# EAGLE design GDEnvSensorGW_1_14 (EAGLE 8.2.1)
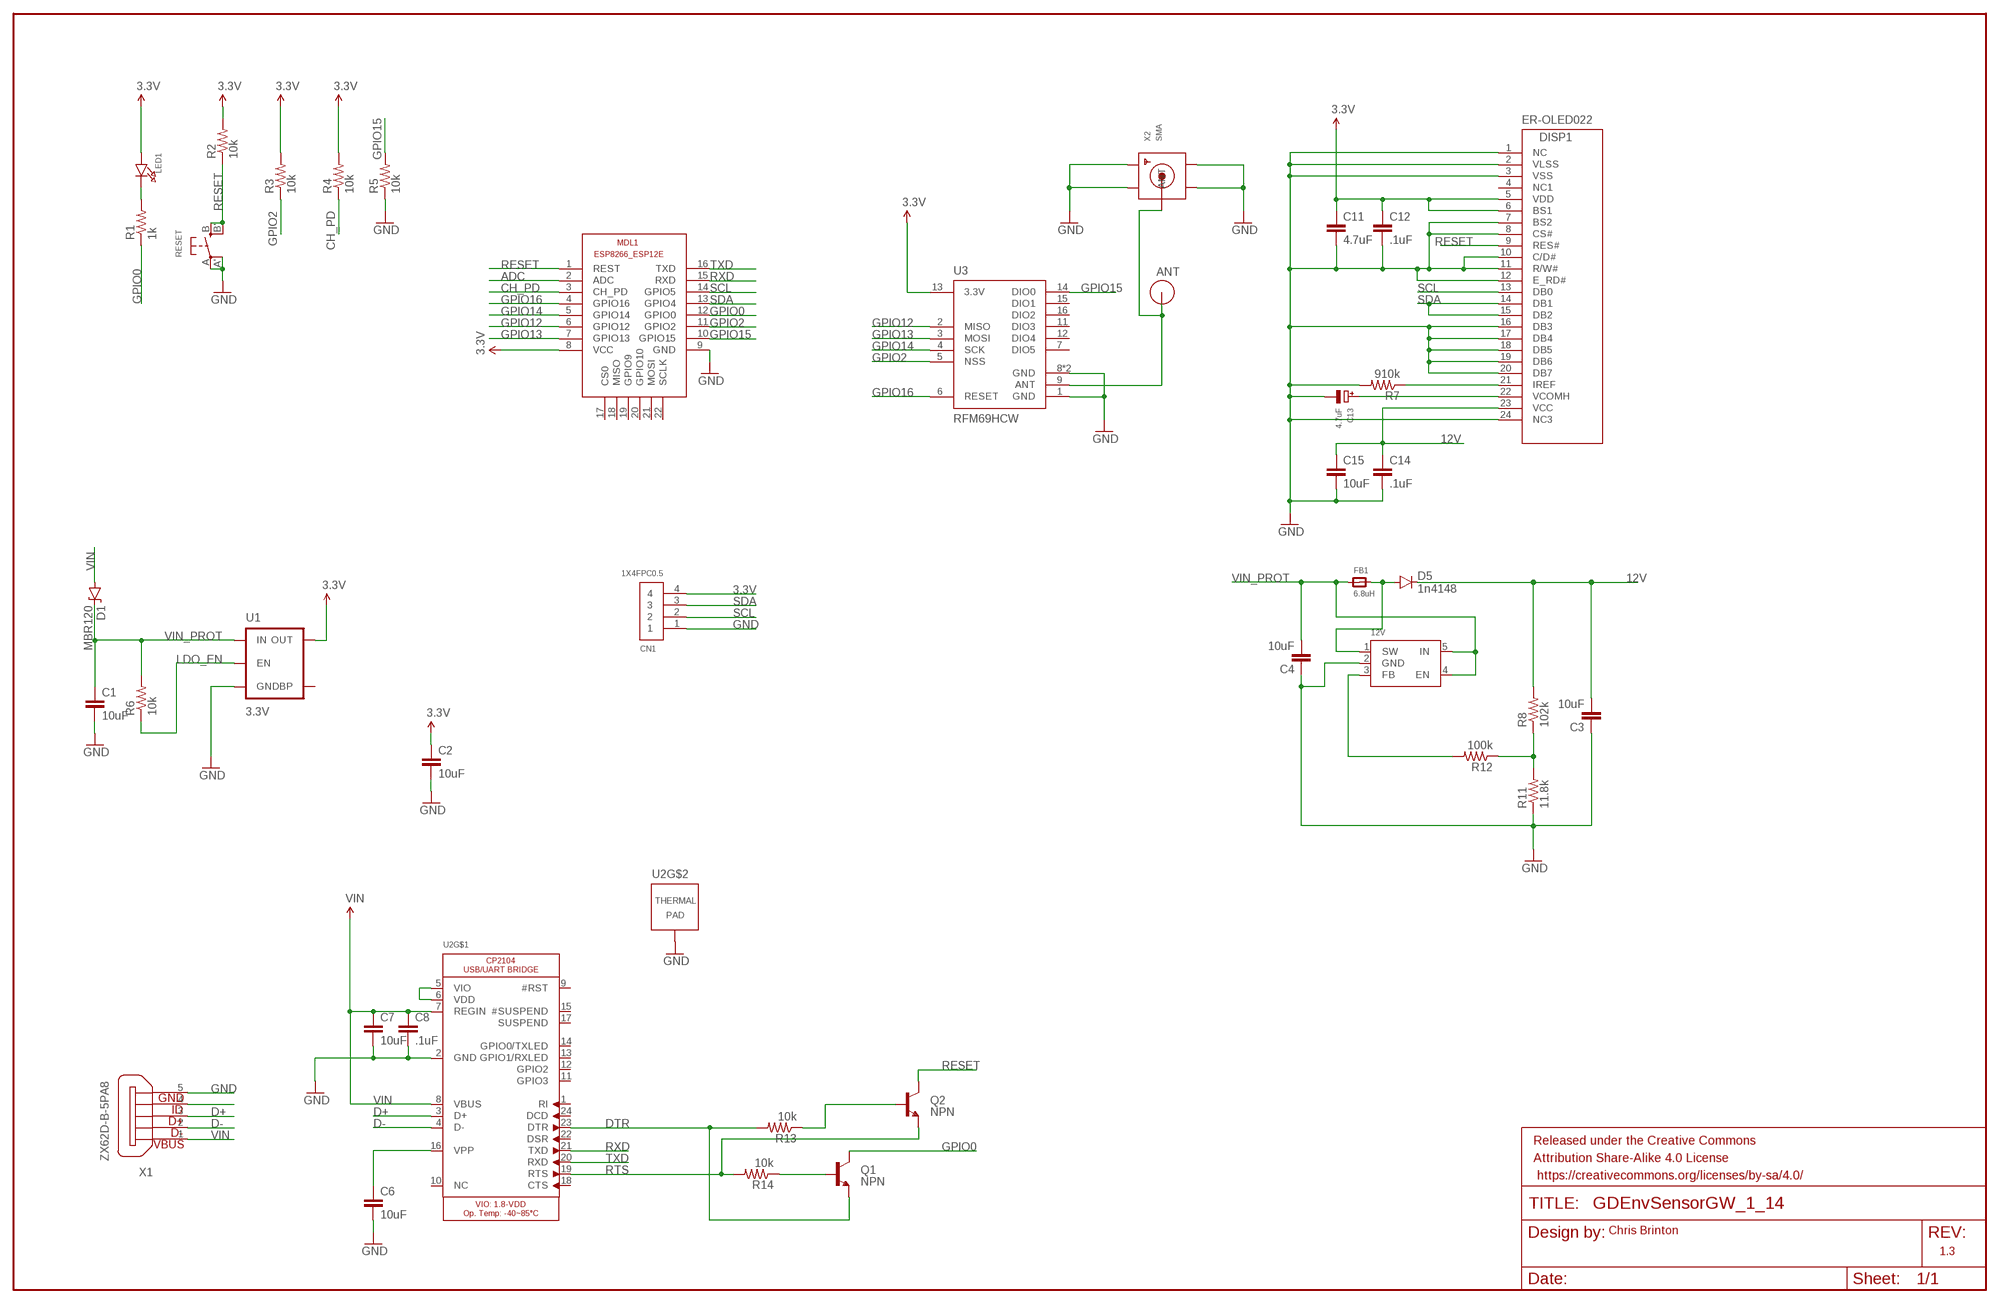
[diagram p0: schematic, sheet 1]

## Parts
12V  MP1541_SOT23-5  [SOT23-5]
ANT  RFM12B_ANTENNA  [RFM12B-ANTENNA]
C1  10uF  10UF10V10%(0805)  [0805-CAP]
C2  10uF  10UF10V10%(0805)  [0805-CAP]
C3  10uF  10UF10V10%(0805)  [0805-CAP]
C4  10uF  10UF10V10%(0805)  [0805-CAP]
C6  10uF  10UF10V10%(0805)  [0805-CAP]
C7  10uF  10UF10V10%(0805)  [0805-CAP]
C8  .1uF  10UF10V10%(0805)  [0805-CAP]
C11  4.7uF  10UF10V10%(0805)  [0805-CAP]
C12  .1uF  10UF10V10%(0805)  [0805-CAP]
C13  4.7uF  CAP_TANTALUMA/3216_REFLOW  [EIA3216-18/A-R]
C14  .1uF  10UF10V10%(0805)  [0805-CAP]
C15  10uF  10UF10V10%(0805)  [0805-CAP]
CN1  1X4FPC0.5  [FPC_0.5MM-4]
D1  MBR120  DIODE-ZENER16V  [SOD-123]
D5  1n4148  DIODEBAS16  [SOD-323]
DISP1  ER-OLED022  [ER-OLED022]
FB1  6.8uH  FERRITE_0805  [_0805]
FRAME1  FRAME-LEDGER  [CREATIVE_COMMONS]
LED1  LED0805  [CHIPLED_0805]
MDL1  ESP8266-ESP12F  ESP8266-12EESP8266-ESP12E  [ESP8266-ESP12E]
Q1  NPN  TRANSISTOR_NPNMMBT2222A  [SOT23-3]
Q2  NPN  TRANSISTOR_NPNMMBT2222A  [SOT23-3]
R1  1k  R-US_R0805  [R0805]
R2  10k  R-US_R0805  [R0805]
R3  10k  R-US_R0805  [R0805]
R4  10k  R-US_R0805  [R0805]
R5  10k  R-US_R0805  [R0805]
R6  10k  R-US_R0805  [R0805]
R7  910k  R-US_R0805  [R0805]
R8  102k  R-US_R0805  [R0805]
R11  11.8k  R-US_R0805  [R0805]
R12  100k  R-US_R0805  [R0805]
R13  10k  R-US_R0805  [R0805]
R14  10k  R-US_R0805  [R0805]
RESET  SWITCH_TACT_SMT4.6X2.8  [BTN_KMR2_4.6X2.8]
U1  3.3V  V_REG_MIC52193.3V  [SOT23-5]
U2  CP2104  [QFN24_4MM_SMSC]
U3  RFM69HCW  [RFM69HCW-XXXS2]
X1  ZX62D-B-5PA8  [ZX62D-B-5PA8]
X2  SMA  SMACONNECTOR_EDGE_UFL  [SMA_EDGELAUNCH_UFL]

## Nets
3.3V: C2.1 C11.1 C12.1 CN1.4 DISP1.5(VDD) DISP1.6(BS1) LED1.A MDL1.8(VCC) R2.2 R3.2 R4.2 U1.5(OUT) U3.13(3.3V)
12V: C3.2 C14.1 C15.1 D5.C DISP1.23(VCC) R8.2
ADC: MDL1.2(ADC)
ANT: ANT.P$1 U3.9(ANT) X2.P(ANT)
CH_PD: MDL1.3(CH_PD) R4.1
D+: U2.3(D+) X1.3
D-: U2.4(D-) X1.2
DTR: Q1.2(E) R13.2 U2.23(DTR)
GND: 12V.2(GND) C1.2 C2.2 C3.1 C4.1 C6.2 C7.2 C8.2 C11.2 C12.2 C13.- C14.2 C15.2 CN1.1 DISP1.1(NC) DISP1.2(VLSS) DISP1.3(VSS) DISP1.7(BS2) DISP1.8(CS#) DISP1.10(C/D#) DISP1.11(R/W#) DISP1.12(E_RD#) DISP1.16(DB3) DISP1.17(DB4) DISP1.18(DB5) DISP1.19(DB6) DISP1.20(DB7) DISP1.24(NC3) MDL1.9(GND) R5.1 R7.2 R11.1 RESET.A'(P1) RESET.A(P) U1.2(GND) U2.2(GND) U2.THERM(TP) U3.1(GND) U3.8(GND) U3.10(GND) X1.5 X2.GND@1(GND1) X2.GND@2(GND2) X2.GND@3(GND3) X2.GND@4(GND4)
GPIO0: MDL1.12(GPIO0) Q1.3(C) R1.1
GPIO2: MDL1.11(GPIO2) R3.1 U3.5(NSS)
GPIO12: MDL1.6(GPIO12) U3.2(MISO)
GPIO13: MDL1.7(GPIO13) U3.3(MOSI)
GPIO14: MDL1.5(GPIO14) U3.4(SCK)
GPIO15: MDL1.10(GPIO15) R5.2 U3.14(DIO0)
GPIO16: MDL1.4(GPIO16) U3.6(RESET)
LDO_EN: R6.1 U1.3(EN)
N$1: U2.5(VIO) U2.6(VDD)
N$3: LED1.C R1.2
N$4: C13.+ DISP1.22(VCOMH)
N$5: C6.1 U2.16(VPP)
N$8: 12V.1(SW) D5.A FB1.2
N$9: Q2.1(B) R13.1
N$10: R8.1 R11.2 R12.1
N$11: DISP1.21(IREF) R7.1
N$15: 12V.3(FB) R12.2
N$16: X1.4
N$17: Q1.1(B) R14.1
RESET: DISP1.9(RES#) MDL1.1(REST) Q2.3(C) R2.1 RESET.B'(S1) RESET.B(S)
RTS: Q2.2(E) R14.2 U2.19(RTS)
RXD: MDL1.15(RXD) U2.21(TXD)
SCL: CN1.2 DISP1.13(DB0) MDL1.14(GPIO5)
SDA: CN1.3 DISP1.14(DB1) DISP1.15(DB2) MDL1.13(GPIO4)
TXD: MDL1.16(TXD) U2.20(RXD)
VIN: C7.1 C8.1 D1.A U2.7(REGIN) U2.8(VBUS) X1.1
VIN_PROT: 12V.4(EN) 12V.5(IN) C1.1 C4.2 D1.C FB1.1 R6.2 U1.1(IN)
Unconnected: DISP1.4(NC1) MDL1.17(CS0) MDL1.18(MISO) MDL1.19(GPIO9) MDL1.20(GPIO10) MDL1.21(MOSI) MDL1.22(SCLK) U1.4(BP) U2.1(RI) U2.9(#RST) U2.10(NC) U2.11(GPIO3) U2.12(GPIO2) U2.13(GPIO1/RXLED) U2.14(GPIO0/TXLED) U2.15(#SUSPEND) U2.17(SUSPEND) U2.18(CTS) U2.22(DSR) U2.24(DCD) U3.7(DIO5) U3.11(DIO3) U3.12(DIO4) U3.15(DIO1) U3.16(DIO2) X1.S1 X1.S2 X1.S3 X1.S4

## Notes on the sheet
- Chris Brinton
- 1.3

## Library data of the parts
12V = GDTech:MP1541_SOT23-5: SOT23-5 MP1541 Voltage Boost The MP1541 is a 5-pin thin SOT23 current mode step up converter intended for small, low power applications
ANT = LowPowerLab:RFM12B_ANTENNA; LABEL: ANT
C1-C4 C6-C8 C11 C12 C14 C15 = SparkFun-Capacitors:10UF10V10%(0805): CAP-11330; PROD_ID: CAP-11330
C13 = microbuilder:CAP_TANTALUM: Tantalum Capacitors Wave footprints have larger pads and are meant to be used for hand soldering. Reflow footprints are optimised for solder paste and a reflow oven. EIA3216-18/A-[R/W] - Size A / 3216-18 / 1206 footprint 4.7µF 25V 10% Tantalum Capacitor 10µF 16V 10% Tantalum Capacitor [Digikey: 495-2236-2-ND] EIA3528-21/B-[R/W] - Size B / 3528-21 47µF 10V 10% Tantalum Capactior [Digikey: 495-2216-1-ND] EIA6032-28/C-[R/W] - Size C / 6032-28 10µF 35V 20% Tantalum Capacitor [Digikey: 495-2285-1-ND] 100µF 16V 10% Tantalum Capactior [Digikey: 399-5214-1-ND]
CN1 = adafruit:1X4: 4-pin connector
D1 = SparkFun-DiscreteSemi:DIODE-ZENER: Zener Diode Production Part - 8199 3.4V Zener Voltage; PROD_ID: DIO-12440; VALUE: 16V
D5 = SparkFun-DiscreteSemi:DIODE: Diode These are standard reverse protection diodes and small signal diodes. SMA package can handle up to about 1A. SOD-323 can handle about 200mA. What the SOD-323 package when ordering, there are some mfgs out there that are 5-pin packages.; PROD_ID: DIO-09646; VALUE: 250mA/100V
DISP1 = GDTech:ER-OLED022: East Rising 2.2" OLED display 128x32 24 pin .5mm pitch FPC connector
FB1 = microbuilder:FERRITE: Ferrite Bead 0603 MMZ1608B121C - 120 Ohm @ 100MHz, 600mA, 0.15 Ohm DC Resistance - Digikey: 445-2164-1-ND BK1608HW121-T - 120 Ohm, 600mA Ferrite Chip - Digikey: 587-1876-2-ND 0805 HZ0805B272R-10 - 2.7K Ohm @ 100MHz, 200mA, 0.8 Ohm DC Resistance - Digikey: 240-2504-1-ND (see also Murata BLM21BD272SN1L) MMZ2012Y152B - 1.5K Ohm @ 100MHz, 500mA, 0.4 Ohm DC Resistance - Digikey: 445-1560-1-ND - Mainly for high frequency (80-400MHz) MMZ2012R102A - 1K Ohm @ 100MHz, 500mA, 0.3 Ohm DC Resistance - Digikey: 445-1555-2-ND - More general purpose (10-200MHz)
FRAME1 = SparkFun-Aesthetics:FRAME-LEDGER: Schematic Frame Standard 11x14 US Ledger frame
LED1 = microbuilder:LED: LED 0603 - 0603 Surface Mount Package 2mA: Green LED - Low Power (3.9mcd, 2ma, 1.7Vf) - Digikey: 475-2709-2-ND Orange LED - Low Power (9.8mcd, 2ma, 1.8Vf) - Digikey: 475-1194-2-ND Red LED - Low Power (5mcd, 2ma, 1.8Vf) - Digikey: 475-1195-2-ND Yellow LED - Low Power (7mcd, 2ma, 1.8Vf) - Digikey: 475-1196-2-ND 5mA: Blue LED - Low Power (17mcd, 5ma, 2.9Vf) - Digikey: LNJ937W8CRACT-ND 0805 - 0805 Surface Mount Package 2mA: Red LED (8.8mcd, 2mA, 1.8Vf, Clear) - Low Power [Digikey: 475-2510-1-ND] Green LED (5mcd, 2mA, 1.8Vf, Clear) - Low Power [Digikey: 475-2730-1-ND] Yellow LED (11.3mcd, 2mA, 1.8Vf, Clear) - Low Power [Digikey: 475-2555-1-ND] 20mA: Red LED (104mcd, 20mA, Diffused) - LS R976 [Digikey: 475-1278-6-ND] Red LED (12mcd, 20mA, 2.0Vf, Clear) - APT2012EC [Digikey: 754-1128-1-ND] Green LED (15mcd, 20mA, 2.2Vf, Clear) - APT2012GC [Digikey: 754-1131-1-ND] Orange LED (160mcd, 20mA, 2.1Vf, Clear) - APT2012SECK [Digikey: 754-1130-1-ND] 1206 - 1206 Surface Mount Package Green LED (26mcd, 20mA, Diffused) - LG N971 [Digikey: 475-1407-6-ND] Red LED (15mcd, 20mA, Diffused) - LH N974 [Digikey: 475-1416-6-ND]
MDL1 = ESP12E:ESP8266-12E: ESP8266-12E with additional I/O and GPIO04/05 corrected The author cannot warrant that this library is free from error or will meet your specific requirements. Created by PuceBaboon.com. Komagane, Nagano, JAPAN
Q1 Q2 = SparkFun-DiscreteSemi:TRANSISTOR_NPN: Generic NPN BJT MMBT2222A - TRANS-08049 (SOT-23, 1A 40V) MPSA42 - TRANS-09116 (SOT-23, 500mA 300V) MMBT5088LT1G - TRANS-11160 (SOT-23, 50 mA 30V) BC547 - COM-08928 <http://www.sparkfun.com/products/8928> (TO-92 45V 100mA) (1.Collector 2.Base 3.Emitter) 2N3904 - COM-00521 <http://www.sparkfun.com/products/521> (TO-92 40V 200mA) (1.Emitter 2.Base 3.Collector) P2N2222A - COM-12852 <http://www.sparkfun.com/products/12852> (TO-92 40V 600mA) (1.Collector 2.Base 3.Emitter); PROD_ID: TRANS-08049; VALUE: MMBT2222A
R1-R8 R11-R14 = adafruit:R-US_: RESISTOR, American symbol
RESET = microbuilder:SWITCH_TACT_SMT: SMT Tact Switches 6x6mm - Digikey: P12940SCT-ND KMR2 (4.6x2.8mm) - Digikey: 401-1426-1-ND EVQ-PQHB55 - Light Touch, 160GF (4.5x4.5mm) - Digikey: P8090SCT-ND
U1 = SparkFun-PowerIC:V_REG_MIC5219: V_REG MIC5219 Standard 3.3V and 5V 500mA LDO voltage regulator in SOT-23 layout. Micrel part MIC5219. BP (by-pass) pin is used to lower output noise with 470pF cap, may be left open.; PROD_ID: VREG-09872; VALUE: MIC5219 3.3V
U2 = GDTech:CP2104: CP2104 - USB to UART Bridge VDD Output: 3.45V
U3 = SparkFun-RF:RFM69H; PROD_ID: IC-11997, IC-12053
X1 = GDTech:ZX62D-B-5PA8: Micro USB Type B Connector - Standard, Shell Through Hole Source: http://www.hirose.co.jp/cataloge_hp/ed_ZX_20140804.pdf; MF: Hirose; MPN: ZX62D-B-5PA8; OC_FARNELL: 2300438; OC_NEWARK: 69W0712
X2 = adafruit:SMACONNECTOR: SMA Connector 90° DIP SMA Connector, 50 Ohm (4UConnector: 07259)

## Board
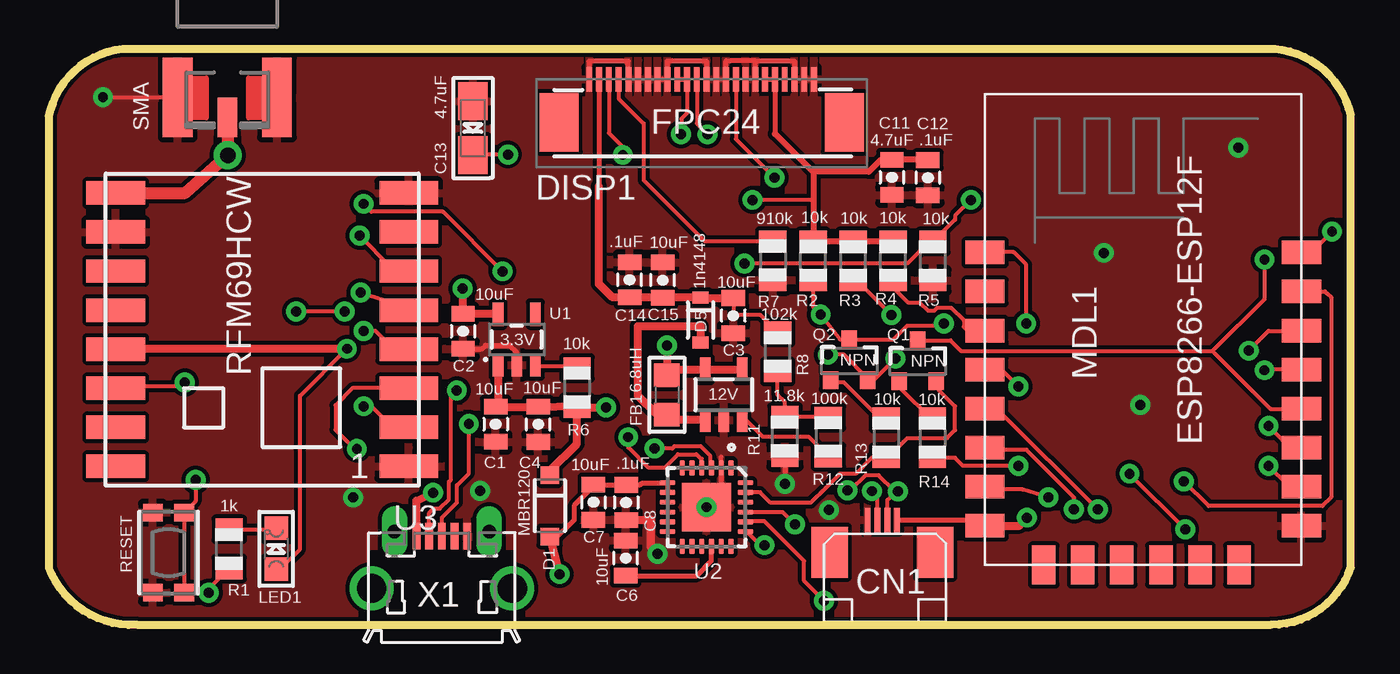
[diagram p1: board, top side]
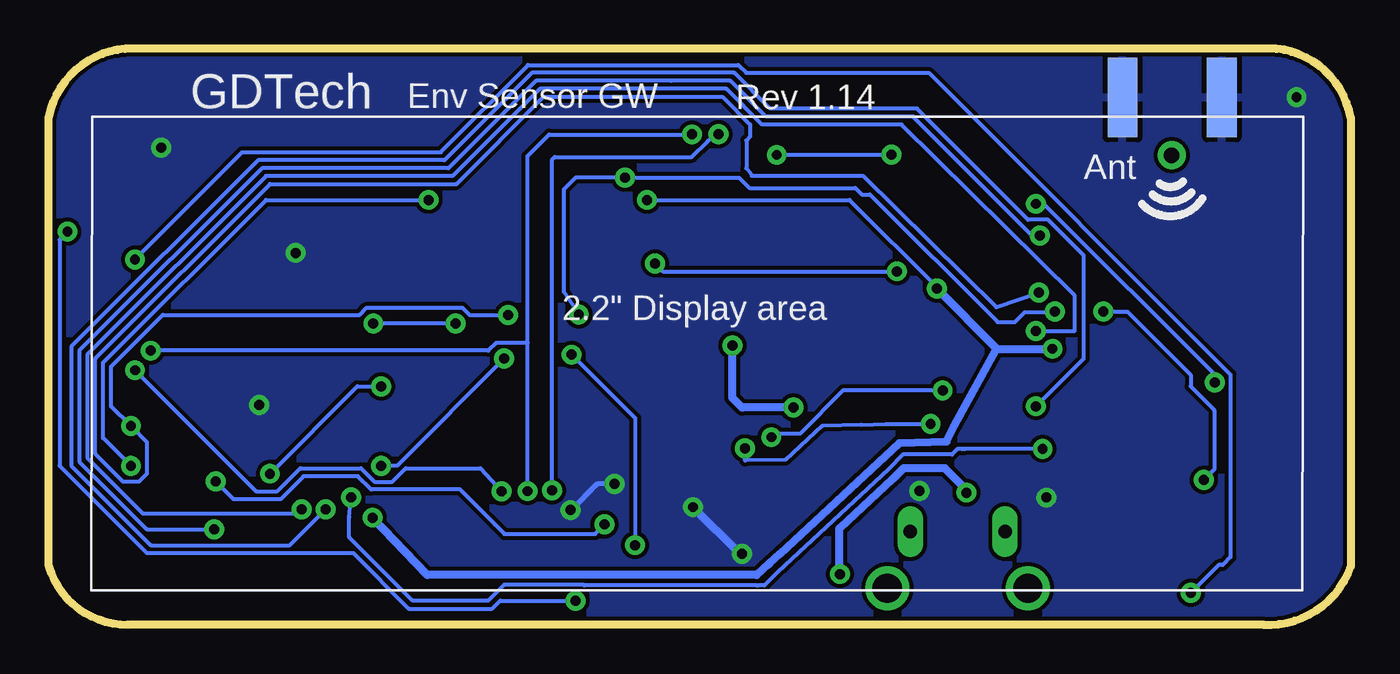
[diagram p2: board, bottom side, seen from below]

Size 66.64 x 29.5 mm. Coordinates in mm from the lower left corner, seen from the top.
Outline: 0,25.99 arc-74 3.8,29.5 62.74,29.5 arc-74 66.64,26.04 66.64,3 arc-74 62.59,0.01 4.49,0.01 arc-74 0,2.97 0,25.99
Copper layers (1*16): Top 0.035mm / dielectric 1.5mm / Bottom 0.035mm
Design rules "SparkFun": minimum track width 8mil, minimum drill 20mil, track to track 8mil, track to pad 8mil, pad to pad 8mil, via to via 8mil, smd to smd 8mil, copper to edge 8mil, drill to drill 8mil, minimum pad ring 12mil, minimum via ring 10mil, stop-mask expansion 4mil, vias tented up to drill 20mil, thermal gap 10mil

### Footprints (pad centres in the part's own frame; a part is rotated, then mirrored left to right if it is on the bottom)
SOT23-5 = smd 0.55 x 1.2: 1 -0.95,-1.3; 2 0,-1.3; 3 0.95,-1.3; 4 0.95,1.3; 5 -0.95,1.3
RFM12B-ANTENNA = drill 0.8 pad 1.422: P$1 0,0
0805-CAP = smd 0.8 x 1.2: 1 -0.9,0; 2 0.9,0
EIA3216-18/A-R = smd 1.95 x 1.5: + 1.375,0; - -1.375,0
FPC_0.5MM-4 = smd 0.3 x 1.25: 1 -0.75,-0.45; 2 -0.25,-0.45; 3 0.25,-0.45; 4 0.75,-0.45 | smd 1.85 x 2.6: MT -2.7,-2.1; MT2 2.7,-2.1
SOD-123 = smd 0.9 x 0.95: A 1.575,0; C -1.575,0
SOD-323 = smd 0.63 x 0.83: A 1.15,0; C -1.15,0
ER-OLED022 = smd 0.3 x 1.25: 1 5.75,12.905; 2 5.25,12.905; 3 4.75,12.905; 4 4.25,12.905; 5 3.75,12.905; 6 3.25,12.905; 7 2.75,12.905; 8 2.25,12.905; 9 1.75,12.905; 10 1.25,12.905; 11 0.75,12.905; 12 0.25,12.905; 13 -0.25,12.905; 14 -0.75,12.905; 15 -1.25,12.905; 16 -1.75,12.905; 17 -2.25,12.905; 18 -2.75,12.905; 19 -3.25,12.905; 20 -3.75,12.905; 21 -4.25,12.905; 22 -4.75,12.905; 23 -5.25,12.905; 24 -5.75,12.905 | smd 2 x 3: MOUNT1 -7.3,10.705; MOUNT2 7.3,10.705
_0805 = smd 1.2 x 1.3: 1 -1.016,0; 2 1.016,0
CHIPLED_0805 = smd 1.2 x 1.2: A 0,-1.05; C 0,1.05
ESP8266-ESP12E = smd 2 x 1.2: 1 0,16; 2 0,14; 3 0,12; 4 0,10; 5 0,8; 6 0,6; 7 0,4; 8 0,2; 9 16.2,2; 10 16.2,4; 11 16.2,6; 12 16.2,8; 13 16.2,10; 14 16.2,12; 15 16.2,14; 16 16.2,16 | smd 1.2 x 2: 17 11,0; 18 3,0; 19 5,0; 20 13,0; 21 7,0; 22 9,0
SOT23-3 = smd 0.8 x 0.9: 1 -0.95,-1; 2 0.95,-1; 3 0,1.1
R0805 = smd 1.1 x 1.4: 1 -1,0; 2 1,0
BTN_KMR2_4.6X2.8 = smd 0.9 x 1: A 2.05,0.8; A' -2.05,0.8; B 2.05,-0.8; B' -2.05,-0.8
QFN24_4MM_SMSC = smd 0.8 x 0.28: 1 -2,1.25; 2 -2,0.75; 3 -2,0.25; 4 -2,-0.25; 5 -2,-0.75; 6 -2,-1.25; 13 2,-1.25; 14 2,-0.75; 15 2,-0.25; 16 2,0.25; 17 2,0.75; 18 2,1.25 | smd 0.28 x 0.8: 7 -1.25,-2; 8 -0.75,-2; 9 -0.25,-2; 10 0.25,-2; 11 0.75,-2; 12 1.25,-2; 19 1.25,2; 20 0.75,2; 21 0.25,2; 22 -0.25,2; 23 -0.75,2; 24 -1.25,2 | smd 2.5 x 2.5: THERM 0,0
RFM69HCW-XXXS2 = smd 3 x 1.2: 1 -7.5,7; 2 -7.5,5; 3 -7.5,3; 4 -7.5,1; 5 -7.5,-1; 6 -7.5,-3; 7 -7.5,-5; 8 -7.5,-7; 9 7.5,-7; 10 7.5,-5; 11 7.5,-3; 12 7.5,-1; 13 7.5,1; 14 7.5,3; 15 7.5,5; 16 7.5,7
ZX62D-B-5PA8 = smd 1.35 x 0.4: 1 4.825,1.3; 2 4.825,0.65; 3 4.825,0; 4 4.825,-0.65; 5 4.825,-1.3 | drill 1.5: S1 2.15,-3.6; S2 2.15,3.6 | drill 0.7 long: S3 5.05,2.425; S4 5.05,-2.425
SMA_EDGELAUNCH_UFL = smd 4.064 x 1.524: GND@1 2.032,-2.54; GND@2 2.032,2.54 | smd 4.064 x 1.524 bottom: GND@3 2.032,2.54; GND@4 2.032,-2.54 | smd 2.032 x 1.016: P 3.048,0

### Placement (x,y rotation side)
12V  34.55,11.79 0 top
ANT  9.16,24.05 0 top
C1  22.87,10.27 270 top
C2  21.2,15.03 270 top
C3  35.04,15.84 90 top
C4  25.05,10.27 90 top
C6  29.53,3.42 90 top
C7  27.88,6.28 270 top
C8  29.55,6.27 270 top
C11  43.16,22.91 270 top
C12  45,22.9 270 top
C13  21.71,25.44 270 top
C14  29.73,17.67 90 top
C15  31.42,17.66 90 top
CN1  42.67,5.82 0 top
D1  25.64,6.1 270 top
D5  33.36,15.61 270 top
DISP1  33.42,15.03 0 top
FB1  31.64,11.78 270 top
FRAME1  1.73,-12.1 0 top  (outside the outline)
LED1  11.64,3.9 0 top
MDL1  47.92,3.07 0 top
Q1  44.47,13.47 0 top
Q2  40.97,13.52 0 top
R1  9.23,3.89 90 top
R2  39.12,18.64 90 top
R3  41.17,18.63 90 top
R4  43.22,18.64 90 top
R5  45.25,18.63 90 top
R6  27.04,12.14 270 top
R7  37.06,18.65 270 top
R8  37.31,13.98 90 top
R11  37.68,9.65 90 top
R12  39.9,9.62 270 top
R13  42.86,9.58 270 top
R14  45.23,9.58 270 top
RESET  6.13,3.7 90 top
U1  23.95,14.61 0 top
U2  33.67,6.03 270 top
U3  10.92,15.12 180 top
X1  20.12,-0.28 90 top
X2  9.14,29.04 270 top

### Tracks (layer width: path | path; a pad name or v marks a point on that pad's centre or on a via)
3.3V  (via drill 0.51, 0.51 pad 1.02)
  Top 0.203: 43.41,5.7 CN1.4 | R3.2 43.21,19.63 R4.2 | LED1.A 11.84,2.86 12.86,3.88 12.86,11.73 15.24,14.12 | 39.13,21.76 v36.02,21.76
  Top 0.254: 37.17,25.15 DISP1.5 DISP1.6 | CN1.4 47.63,5.37 MDL1.8
  Top 0.305: 39.13,23.19 39.13,21.76 R2.2 R4.2 | 37.17,25.15 39.13,23.19 | C12.1 44.98,23.81 C11.1 42.58,23.81 41.97,23.2 39.14,23.2 39.13,23.19
  Top 0.406: U1.5 21.23,15.91 C2.1 21.18,15.95 v21.18,17.22 | U3.13 15.24,14.12 v15.26,14.14 | MDL1.8 49.68,5.07 v50.07,5.49
  Bottom 0.203: v36.02,21.76 25.66,21.76 21.19,17.29 v21.18,17.22
  Bottom 0.406: 18.1,14.14 v15.26,14.14 | 18.1,14.14 v21.18,17.22 | v50.07,5.49 47.27,2.56 30.48,2.57 30.41,2.55 29.77,3.12 29.22,3.63 23.11,9.31 20.68,9.38 20.29,10.21 18.16,14.08 18.1,14.14
12V
  Top 0.203: C3.2 35.04,15.95 35.1,15.89 36.4,15.89 R8.2
  Top 0.254: DISP1.23 28.17,22.47 28.15,22.46
  Top 0.406: C3.2 33.38,16.74 D5.C C15.1 C14.1 28.86,16.77 28.15,17.48 28.15,22.46
ANT
  Top 0.61: U3.9 6.97,22.12 ANT.P$1 9.17,24.32 X2.P
CH_PD
  Top 0.203: R4.1 43.22,17.28 43.98,16.52 44.57,16.52 45,16.09 45.33,16.09 45.48,16.24 46.19,16.24 46.83,15.6 46.83,15.26 47,15.09 47.91,15.09 MDL1.3
D+  (via drill 0.51 pad 1.02)
  Top 0.203: U2.3 33.86,8.08 33.86,8.65 33.37,9.14 32.03,9.14 31.92,9.03 v31,9.03 | v21.5,10.29 21.5,7.76 20.89,7.15 20.89,6.26 20.12,5.49 X1.3
  Bottom 0.203: v21.5,10.29 23.81,10.28 25.05,10.24 27.06,10.18 28.94,8.45 31,8.41 v31,9.03
D-  (via drill 0.51, 0.51 pad 1.02)
  Top 0.203: X1.2 19.47,5.73 19.7,5.95 20.01,5.95 20.48,6.43 20.48,7.32 20.59,7.43 20.59,11.7 v20.88,12 | 33.38,8.15 U2.4 33.42,8.52 33.36,8.52 33.14,8.73 32.19,8.73 31.51,8.05 30.7,8.05 29.67,9.08 29.64,9.59 v29.66,9.61
  Bottom 0.203: v20.88,12 24.64,12.01 25.98,12.01 28.2,9.79 29.68,9.79 v29.66,9.61
DTR
  Top 0.203: 39.77,7.02 40.49,7.74 41.3,7.74 42.12,8.55 42.72,8.55 R13.2 42.93,8.55 43.94,9.57 45.98,9.57 46.38,9.97 46.38,11.19 45.57,12.01 45.57,12.41 Q1.2 | 39.77,7.02 39.47,6.72 | 35.82,6.72 U2.23 36.41,6.79 36.95,6.25 39,6.25 39.77,7.02
GND  (via drill 0.51 pad 1.02)
  Top 0.203: DISP1.11 DISP1.10 | DISP1.2 DISP1.1 | U2.2 34.39,8.15 34.39,8.55 34.42,8.6 | X2.GND@1 2.78,27.01 v2.77,27.02
  Top 0.254: DISP1.16 31.68,27.93 31.69,27.93 DISP1.16 | U2.2 34.42,6.78 U2.THERM | C2.2 22.16,14.13 22.35,14.32 23.59,14.32 23.94,13.97 U1.2 | R11.1 v37.68,7.23 v37.69,7.22 | DISP1.24 27.67,28.84 27.66,28.85 27.66,28.88 27.67,28.89 29.66,28.89 DISP1.20 | 31.67,28.89 31.67,28.86 | 31.67,28.89 31.92,28.89 31.9,28.89 33.66,28.89 DISP1.12 | DISP1.10 34.67,28.86 34.67,28.9 34.86,28.89 34.88,28.89 36.16,28.89 | DISP1.7 36.17,28.88 36.16,28.89 | 36.16,28.89 38.15,28.89 38.16,28.88 DISP1.3 | DISP1.16 31.67,28.88 31.67,28.89 | DISP1.17 DISP1.16
  Top 0.406: C8.2 30.78,5.37 30.8,5.39 30.8,3.98 v31.15,3.63
  Bottom 0.254: v37.69,7.22 38.57,7.22 39.94,5.85 v39.94,5.88
  Bottom 0.406: v31.15,3.63 31.27,3.63 U2.THERM
  other vias: 33.67,6.03 54,19.05 60.89,24.44 55.88,11.27 22.08,6.87 15.58,6.52
  pour Top: 4.08,30.46 62.57,29.62 arc-90 66.67,25.52 67.67,3.52 arc-90 63.07,-0.08 3.86,-0.02 arc-90 -0.05,3.04 -0.08,26.19 arc-90
  pour Bottom: 4.27,29.32 63.04,30.03 arc-90 67.77,24.82 66.77,3.52 arc-90 63.27,0.02 4.17,-1.38 arc-90 0.06,2.64 0.07,25.22 arc-90
GPIO0  (via drill 0.51)
  Top 0.203: Q1.3 46.16,14.57 46.7,14.03 59.56,14.03 | 59.56,14.03 62.53,11.06 64.11,11.06 MDL1.12 | v8.18,1.64 8.18,1.85 9.2,2.86 R1.1 | v62.23,18.71 62.23,16.68 59.59,14.04 59.56,14.03
  Bottom 0.203: v8.18,1.64 6.76,3.07 6.56,3.07 6.15,3.47 6.15,12.82 21.59,28.26 30.94,28.26 31.35,28.67 42.12,28.67 46.59,24.2 56.75,24.2 v62.23,18.71
GPIO2  (via drill 0.51)
  Top 0.203: v43.13,15.87 41.51,17.49 41.3,17.49 R3.1 | v62.44,10.18 63.45,9.16 64.06,9.16 MDL1.11 | v15.97,17.02 18.34,16.27 U3.5
  Bottom 0.203: v15.97,17.02 18.14,16.27 24.97,22.99 30.66,22.99 30.94,23.39 30.94,24.81 30.74,25.01 30.74,25.62 32.16,27.04 41.3,27.04 45.77,22.57 55.32,22.57 64.26,13.63 64.26,8.76 62.84,7.33 62.03,7.33 61.62,7.74 61.62,9.36 v62.44,10.18 63.45,11.19 63.45,13.23 60.81,15.87 50.74,15.87 50.37,16.24 45.48,16.24 45.11,15.87 v43.13,15.87
GPIO12  (via drill 0.51)
  Top 0.203: v52.48,5.91 52.48,6.52 50.04,8.96 48.01,8.96 MDL1.6 | v16.11,11.19 16.51,11.19 17.53,10.18 18.34,10.18 U3.2
  Bottom 0.203: v52.48,5.91 54.31,4.08 61.42,4.08 65.48,8.15 65.48,14.24 55.93,23.79 46.38,23.79 41.91,28.26 31.55,28.26 29.72,26.43 22.2,26.43 16.51,20.74 15.5,20.74 13.67,18.92 13.67,13.63 v16.11,11.19
GPIO13  (via drill 0.51, 0.51 pad 1.02)
  Top 0.203: v51.17,6.52 49.84,6.93 48.01,6.93 MDL1.7 | 19.36,12.01 18.54,12.01 U3.3 15.55,12.12 14.67,11.24 14.67,9.99 15.66,9 15.75,9 v15.77,9.02
  Bottom 0.203: v51.17,6.52 51.26,5.5 51.26,4.49 48.01,1.24 44.15,1.24 43.33,2.05 39.27,2.05 39.24,2.02 30.4,2.02 30.35,2 30.32,2.02 30.01,2.02 29.35,2.68 23.66,7.97 22.91,8.72 20.41,8.72 20.12,9.01 19.77,9.01 | v15.77,9.02 18.11,9.02 19.77,9.01 | 19.77,9.01 19.9,9.01
GPIO14  (via drill 0.51)
  Top 0.203: v53.7,5.91 48.62,10.99 48.01,10.99 MDL1.5 | v16.11,15.05 16.72,15.05 17.53,14.24 18.34,14.24 U3.4
  Bottom 0.203: v53.7,5.91 53.9,5.71 61.83,5.71 64.67,8.55 64.67,13.84 55.53,22.98 45.98,22.98 41.51,27.45 31.96,27.45 30.13,25.62 22.99,25.62 14.12,16.86 14.12,15.06 v16.11,15.05
GPIO15  (via drill 0.51)
  Top 0.203: v47.2,21.76 46.38,20.95 46.38,20.74 45.37,19.73 R5.2 45.16,19.73 43.94,18.51 v35.61,18.51 | v62.44,8.15 63.45,7.13 64.06,7.13 MDL1.10 | v6.96,12.41 6.76,12.21 3.51,12.21 U3.14 | v16.11,21.56 16.51,21.15 20.17,21.15 v23.22,18.1
  Bottom 0.203: v47.2,21.76 55.53,21.76 63.86,13.43 63.86,9.57 v62.44,8.15 | v6.96,12.41 6.96,12.82 15.7,21.56 v16.11,21.56 | v23.22,18.1 35.21,18.1 v35.61,18.51
GPIO16  (via drill 0.51)
  Top 0.203: v49.63,12.21 48.82,13.02 48.01,13.02 MDL1.4 | v58.17,4.89 v55.32,7.74 | v15.9,19.93 17.53,18.31 18.34,18.31 U3.6
  Bottom 0.203: v49.63,12.21 50.85,12.21 v55.32,7.74 | v58.17,4.89 61.62,4.89 65.08,8.35 65.08,14.04 55.73,23.39 46.18,23.39 41.71,27.86 34.77,27.86 31.75,27.86 29.92,26.03 22.41,26.03 16.31,19.93 v15.9,19.93
LDO_EN
  Top 0.203: U1.3 25.05,13.23 26.88,13.23 R6.1
N$1
  Top 0.254: U2.6 U2.5
N$3
  Top 0.203: R1.2 11.59,4.89 LED1.C
N$4  (via drill 0.51 pad 1.02)
  Top 0.203: DISP1.22 28.67,25.18 29.36,24.49 29.36,24.09 v29.38,24.07 | v23.5,24.09 21.73,24.09 C13.+
  Bottom 0.203: v29.38,24.07 23.52,24.07 v23.5,24.09
N$5
  Top 0.254: C6.1 33.17,2.52 33.92,3.27 U2.16
N$8
  Top 0.406: 12V.1 31.91,10.49 FB1.2 31.13,10.76 30.16,11.73 30.16,13.9 30.15,15.3 33.36,15.3 D5.A
N$9
  Top 0.203: Q2.1 40.08,12.41 40.69,12.41 42.72,10.38 R13.1
N$10
  Top 0.203: R8.1 37.31,11.78 37.68,11.41 R11.2 39.87,10.65 R12.1
N$11
  Top 0.203: DISP1.21 29.17,26.95 30.45,25.67 30.45,22.77 33.57,19.65 R7.1
N$15
  Top 0.203: 35.54,10.49 12V.3 35.69,10.49 36.54,9.64 38.88,9.64 R12.2
N$17
  Top 0.203: Q1.1 43.52,12.19 45.22,10.49 R14.1
RESET  (via drill 0.51 pad 1.02)
  Top 0.203: RESET.B' RESET.B 7.51,6.33 v7.51,7.42 | 39.17,17.59 R2.1 39.12,16.28 v39.51,15.9 40.49,14.62 Q2.3 43.24,14.62 43.94,15.32 45,15.32 | 45,15.32 45.01,15.31 | 45,15.32 45.72,15.32 v45.82,15.43 | v50.03,15.43 50.03,18.45 49.4,19.08 MDL1.1 | DISP1.9 35.17,24.88 v37.15,22.9 | v15.15,16.04 v12.66,16.04
  Bottom 0.203: v45.82,15.43 v50.03,15.43 | v39.51,15.9 40.29,17.06 40.29,22.3 39.69,22.9 v37.15,22.9 31.31,22.9 30.78,22.37 25.36,22.37 25.03,22.04 24.61,22.04 18.07,15.5 17.2,15.5 16.68,16.02 15.17,16.02 v15.15,16.04 | v12.66,16.04 11.42,16.04 8.19,12.81 8.19,12.21 6.98,11 6.98,7.95 v7.51,7.42
RTS  (via drill 0.51)
  Top 0.203: v36.63,4.08 36.43,4.08 35.82,4.69 U2.19 | v39.88,13.84 40.69,13.84 41.91,12.62 Q2.2 42.12,12.41 v43.33,13.63 | v49.63,8.15 46.79,8.15 46.38,8.55 45.37,8.55 R14.2
  Bottom 0.203: v36.63,4.08 36.63,10.58 v39.88,13.84 | v49.63,8.15 48.82,8.15 v43.33,13.63
RXD  (via drill 0.51 pad 1.02)
  Top 0.203: U2.21 37.56,5.78 v38.19,5.15 | MDL1.15 65.33,17.07 65.42,16.98 65.44,16.98 65.64,16.78 65.64,6.54 65.19,6.09 59.37,6.09 v58.11,7.35
  Bottom 0.203: v58.11,7.35 57.19,6.43 54.78,6.43 53.6,7.61 50.82,7.61 50.14,6.93 45.58,6.93 43.8,5.15 43.8,5.14 43.32,4.66 38.68,4.66 v38.19,5.15
SCL  (via drill 0.51, 0.51 pad 1.02)
  Top 0.203: DISP1.13 33.17,25.67 v33.72,25.12 | CN1.2 42.42,6.57 v42.14,6.85 | v61.42,14.04 62.44,15.05 64.06,15.05 MDL1.14
  Bottom 0.203: v42.14,6.85 42.14,14.44 | 42.14,14.44 42.14,24 41.03,25.11 v33.73,25.11 v33.72,25.12 | v61.42,14.04 44.15,14.04 43.74,14.44 42.14,14.44 | 42.12,14.44 42.14,14.44
SDA  (via drill 0.51 pad 1.02)
  Top 0.203: v32.36,25.13 v32.37,25.13 32.38,25.14 32.38,25.92 32.67,26.2 DISP1.14 | CN1.3 42.92,6.4 v43.46,6.83 43.31,6.83 42.48,7.66 41.8,7.66 41.02,6.88 v40.88,6.88 | MDL1.13 62.26,13.07 v62.23,13.04
  Top 0.254: DISP1.15 DISP1.14
  Bottom 0.203: 62.25,13.06 v62.23,13.04 56.03,6.84 54.95,6.84 53.77,8.02 50.66,8.02 49.97,7.33 49.06,7.33 48.37,8.02 44.54,8.02 v43.46,6.83 | v40.88,6.88 40.88,23.83 40.75,23.96 33.73,23.96 32.91,24.78 32.56,25.14 v32.37,25.13
TXD  (via drill 0.51)
  Top 0.203: v39.68,1.24 38.66,2.25 38.66,3.27 36.63,5.3 35.82,5.3 U2.20 | v65.69,20.13 64.67,19.12 64.26,19.12 MDL1.16
  Bottom 0.203: v39.68,1.24 43.54,1.24 43.94,0.83 48.21,0.83 51.06,3.68 61.62,3.68 66.09,8.15 66.09,19.73 v65.69,20.13
VIN  (via drill 0.51 pad 1.02)
  Top 0.254: D1.A 25.85,4.32 26.89,5.36 26.89,6.12 27.88,7.11 C7.1 C8.1 30.27,7.17 30.37,7.27 U2.7 U2.8
  Top 0.406: X1.1 18.82,6.36 v19.67,6.77 | D1.A 26.07,2.84 v26.14,2.6
  Bottom 0.406: v19.67,6.77 19.67,6.92 20.77,8.02 22.88,8.02 23.3,7.6 23.45,7.46 23.46,7.46 26.13,4.98 26.19,4.92 26.19,2.65 v26.14,2.6
VIN_PROT  (via drill 0.51 pad 1.02)
  Top 0.406: U1.1 23,11.3 C1.1 24.77,11.17 C4.2 26.96,11.22 R6.2 | D1.C 25.64,7.88 27.03,9.27 R6.2 | R6.2 28.51,11.14 v28.53,11.13 | v31.64,14.3 FB1.1 31.93,13.09 12V.5 12V.4
  Bottom 0.406: v28.53,11.13 31.15,11.13 31.65,11.63 v31.65,14.29 v31.64,14.3

### Text on the board
bPlace: Rev 1.14 | Env Sensor GW | GDTech | Ant